# EAGLE design Arduino_MEGA2560_ref (EAGLE 6.5.0)
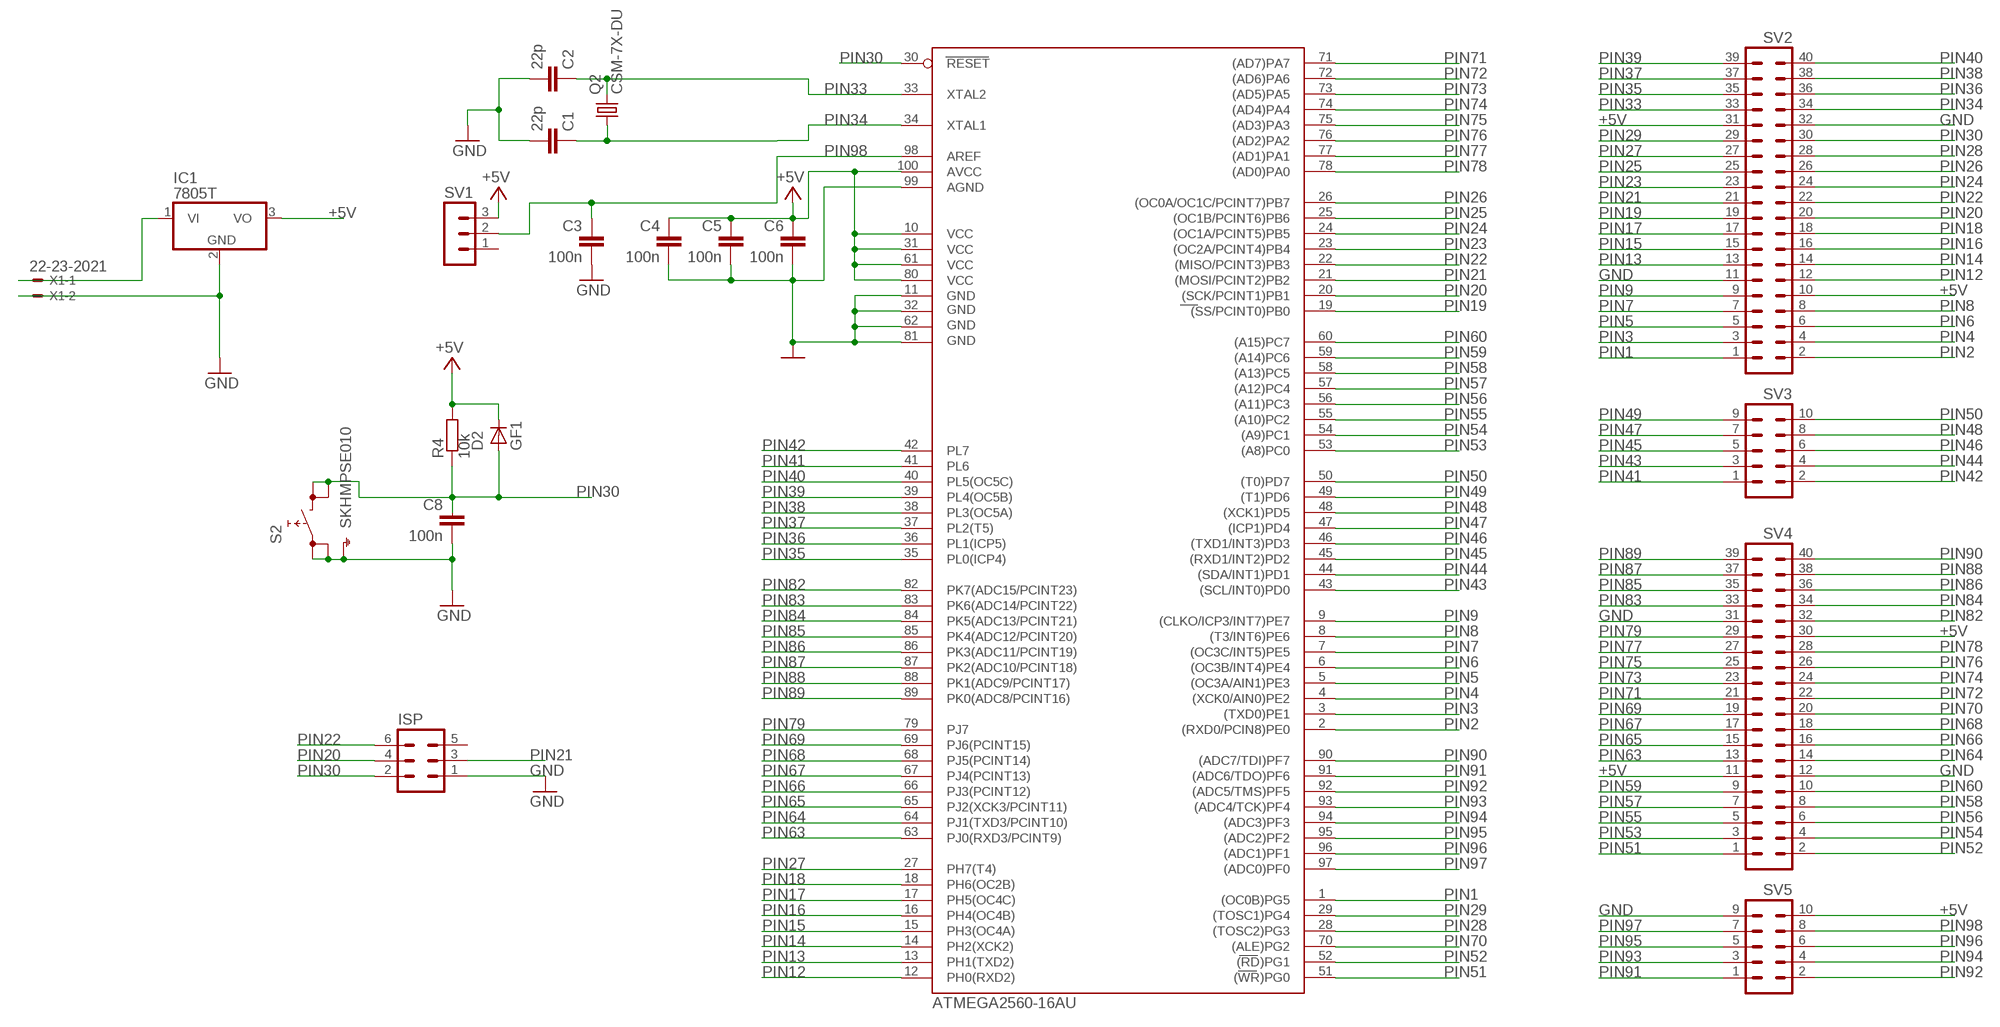
[diagram p0: schematic, sheet 1]

## Parts
C1  22p  C-EU0603-RND  [C0603-ROUND]
C2  22p  C-EU0603-RND  [C0603-ROUND]
C3  100n  C-EU0603-RND  [C0603-ROUND]
C4  100n  C-EU0603-RND  [C0603-ROUND]
C5  100n  C-EU0603-RND  [C0603-ROUND]
C6  100n  C-EU0603-RND  [C0603-ROUND]
C8  100n  C-EU0603-RND  [C0603-ROUND]
D2  GF1  [SMA-DO214AC]
IC1  7805T  [TO220H]
IC3  ATMEGA2560-16AU  ATMEGA1280-16AU  [TQFP100]
ISP  MA03-2  [MA03-2]
Q2  CSM-7X-DU  [CSM-7X-DU]
R4  10k  SMS-0  [SMS-0]
S2  SKHMPSE010  [SKHMPXE010]
SV1  MA03-1  [MA03-1]
SV2  MA20-2  [MA20-2]
SV3  MA05-2  [MA05-2]
SV4  MA20-2  [MA20-2]
SV5  MA05-2  [MA05-2]
X1  22-23-2021  [22-23-2021]

## Nets
+5V: C4.1 C5.1 C6.1 D2.K(C) IC1.3(VO) IC3.10(VCC) IC3.31(VCC1) IC3.61(VCC2) IC3.80(VCC3) IC3.100(AVCC) R4.1 SV1.3 SV2.10 SV2.31 SV4.11 SV4.30 SV5.10
GND: C1.2 C2.2 C3.2 C4.2 C5.2 C6.2 C8.2 IC1.2(GND) IC3.11(GND) IC3.32(GND1) IC3.62(GND2) IC3.81(GND3) IC3.99(AGND) ISP.1 S2.1(1.1) S2.2(1.2) S2.5(SH) SV2.11 SV2.32 SV4.12 SV4.31 SV5.9 X1.2
N$5: IC1.1(VI) X1.1
PIN1: IC3.1((OC0B)PG5) SV2.1
PIN2: IC3.2((RXD0/PCIN8)PE0) SV2.2
PIN3: IC3.3((TXD0)PE1) SV2.3
PIN4: IC3.4((XCK0/AIN0)PE2) SV2.4
PIN5: IC3.5((OC3A/AIN1)PE3) SV2.5
PIN6: IC3.6((OC3B/INT4)PE4) SV2.6
PIN7: IC3.7((OC3C/INT5)PE5) SV2.7
PIN8: IC3.8((T3/INT6)PE6) SV2.8
PIN9: IC3.9((CLKO/ICP3/INT7)PE7) SV2.9
PIN12: IC3.12(PH0(RXD2)) SV2.12
PIN13: IC3.13(PH1(TXD2)) SV2.13
PIN14: IC3.14(PH2(XCK2)) SV2.14
PIN15: IC3.15(PH3(OC4A)) SV2.15
PIN16: IC3.16(PH4(OC4B)) SV2.16
PIN17: IC3.17(PH5(OC4C)) SV2.17
PIN18: IC3.18(PH6(OC2B)) SV2.18
PIN19: IC3.19((SS/PCINT0)PB0) SV2.19
PIN20: IC3.20((SCK/PCINT1)PB1) ISP.4 SV2.20
PIN21: IC3.21((MOSI/PCINT2)PB2) ISP.3 SV2.21
PIN22: IC3.22((MISO/PCINT3)PB3) ISP.6 SV2.22
PIN23: IC3.23((OC2A/PCINT4)PB4) SV2.23
PIN24: IC3.24((OC1A/PCINT5)PB5) SV2.24
PIN25: IC3.25((OC1B/PCINT6)PB6) SV2.25
PIN26: IC3.26((OC0A/OC1C/PCINT7)PB7) SV2.26
PIN27: IC3.27(PH7(T4)) SV2.27
PIN28: IC3.28((TOSC2)PG3) SV2.28
PIN29: IC3.29((TOSC1)PG4) SV2.29
PIN30: C8.1 D2.A IC3.30(RESET) ISP.2 R4.2 S2.3(2.1) S2.4(2.2) SV2.30
PIN33: C2.1 IC3.33(XTAL2) Q2.2 SV2.33
PIN34: C1.1 IC3.34(XTAL1) Q2.1 SV2.34
PIN35: IC3.35(PL0(ICP4)) SV2.35
PIN36: IC3.36(PL1(ICP5)) SV2.36
PIN37: IC3.37(PL2(T5)) SV2.37
PIN38: IC3.38(PL3(OC5A)) SV2.38
PIN39: IC3.39(PL4(OC5B)) SV2.39
PIN40: IC3.40(PL5(OC5C)) SV2.40
PIN41: IC3.41(PL6) SV3.1
PIN42: IC3.42(PL7) SV3.2
PIN43: IC3.43((SCL/INT0)PD0) SV3.3
PIN44: IC3.44((SDA/INT1)PD1) SV3.4
PIN45: IC3.45((RXD1/INT2)PD2) SV3.5
PIN46: IC3.46((TXD1/INT3)PD3) SV3.6
PIN47: IC3.47((ICP1)PD4) SV3.7
PIN48: IC3.48((XCK1)PD5) SV3.8
PIN49: IC3.49((T1)PD6) SV3.9
PIN50: IC3.50((T0)PD7) SV3.10
PIN51: IC3.51((WR)PG0) SV4.1
PIN52: IC3.52((RD)PG1) SV4.2
PIN53: IC3.53((A8)PC0) SV4.3
PIN54: IC3.54((A9)PC1) SV4.4
PIN55: IC3.55((A10)PC2) SV4.5
PIN56: IC3.56((A11)PC3) SV4.6
PIN57: IC3.57((A12)PC4) SV4.7
PIN58: IC3.58((A13)PC5) SV4.8
PIN59: IC3.59((A14)PC6) SV4.9
PIN60: IC3.60((A15)PC7) SV4.10
PIN63: IC3.63(PJ0(RXD3/PCINT9)) SV4.13
PIN64: IC3.64(PJ1(TXD3/PCINT10)) SV4.14
PIN65: IC3.65(PJ2(XCK3/PCINT11)) SV4.15
PIN66: IC3.66(PJ3(PCINT12)) SV4.16
PIN67: IC3.67(PJ4(PCINT13)) SV4.17
PIN68: IC3.68(PJ5(PCINT14)) SV4.18
PIN69: IC3.69(PJ6(PCINT15)) SV4.19
PIN70: IC3.70((ALE)PG2) SV4.20
PIN71: IC3.71((AD7)PA7) SV4.21
PIN72: IC3.72((AD6)PA6) SV4.22
PIN73: IC3.73((AD5)PA5) SV4.23
PIN74: IC3.74((AD4)PA4) SV4.24
PIN75: IC3.75((AD3)PA3) SV4.25
PIN76: IC3.76((AD2)PA2) SV4.26
PIN77: IC3.77((AD1)PA1) SV4.27
PIN78: IC3.78((AD0)PA0) SV4.28
PIN79: IC3.79(PJ7) SV4.29
PIN82: IC3.82(PK7(ADC15/PCINT23)) SV4.32
PIN83: IC3.83(PK6(ADC14/PCINT22)) SV4.33
PIN84: IC3.84(PK5(ADC13/PCINT21)) SV4.34
PIN85: IC3.85(PK4(ADC12/PCINT20)) SV4.35
PIN86: IC3.86(PK3(ADC11/PCINT19)) SV4.36
PIN87: IC3.87(PK2(ADC10/PCINT18)) SV4.37
PIN88: IC3.88(PK1(ADC9/PCINT17)) SV4.38
PIN89: IC3.89(PK0(ADC8/PCINT16)) SV4.39
PIN90: IC3.90((ADC7/TDI)PF7) SV4.40
PIN91: IC3.91((ADC6/TDO)PF6) SV5.1
PIN92: IC3.92((ADC5/TMS)PF5) SV5.2
PIN93: IC3.93((ADC4/TCK)PF4) SV5.3
PIN94: IC3.94((ADC3)PF3) SV5.4
PIN95: IC3.95((ADC2)PF2) SV5.5
PIN96: IC3.96((ADC1)PF1) SV5.6
PIN97: IC3.97((ADC0)PF0) SV5.7
PIN98: C3.1 IC3.98(AREF) SV1.2 SV5.8
Unconnected: ISP.5 SV1.1

## Library data of the parts
C1-C6 C8 = SmartPrj:C-EU: CAPACITOR, European symbol
D2 = diode:GF1: DIODE
IC1 = linear:78*: Positive VOLTAGE REGULATOR Source: http://cache.national.com/ds/LM/LM78L05.pdf http://www.fairchildsemi.com/ds/LM/LM7805.pdf
IC3 = atmel-2005:ATMEGA*: MICROCONTROLLER 64/128/256 Kbytes FLASH 4 Kbytes EEPROM 8 Kbytes SRAM 86 General Purpose I/O pins 12-channels16-bit PWM 4 x Serial USARTs 16-channels 10-bit A/D
ISP = con-lstb:MA03-2: PIN HEADER; OC_FARNELL: unknown; OC_NEWARK: unknown
Q2 = crystal:CSM-7X-DU: SMD CRYSTAL Source: www.ecsxtal.com .. Crystal 3.6864MHz CSM_7X_DU.PDF; OC_FARNELL: unknown; OC_NEWARK: unknown
R4 = resistor-shunt:SMS-0: SMD SHUNT RESISTOR; OC_FARNELL: unknown; OC_NEWARK: unknown
S2 = switch:SKHMP*E010: 6.2 X 6.5mm TACT Switch (SMD) Source: http://www3.alps.co.jp/WebObjects/catalog.woa/PDF/E/Switch/Tact/SKHM/SKHM.PDF
SV1 = con-lstb:MA03-1: PIN HEADER; OC_FARNELL: unknown; OC_NEWARK: unknown
SV2 SV4 = con-lstb:MA20-2: PIN HEADER; OC_FARNELL: unknown; OC_NEWARK: unknown
SV3 SV5 = con-lstb:MA05-2: PIN HEADER; OC_FARNELL: unknown; OC_NEWARK: unknown
X1 = con-molex:22-23-2021: .100" (2.54mm) Center Header - 2 Pin; MF: MOLEX; MPN: 22-23-2021; OC_FARNELL: 1462926; OC_NEWARK: 25C3832

## Net classes
0 default: width 0.152 mm, drill 0.305 mm, clearance 0.152 mm

## Board
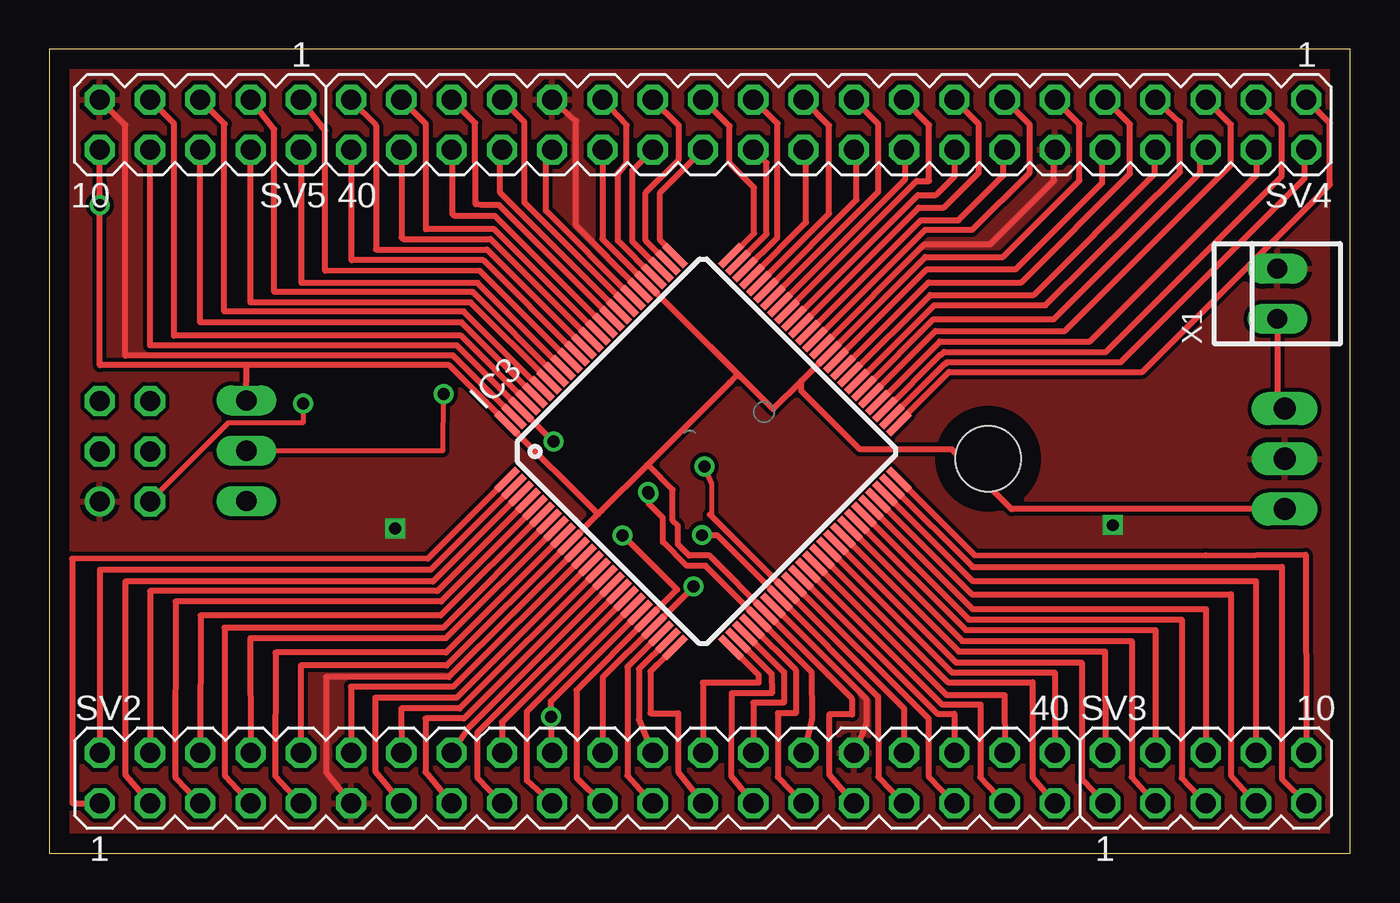
[diagram p1: board, top side]
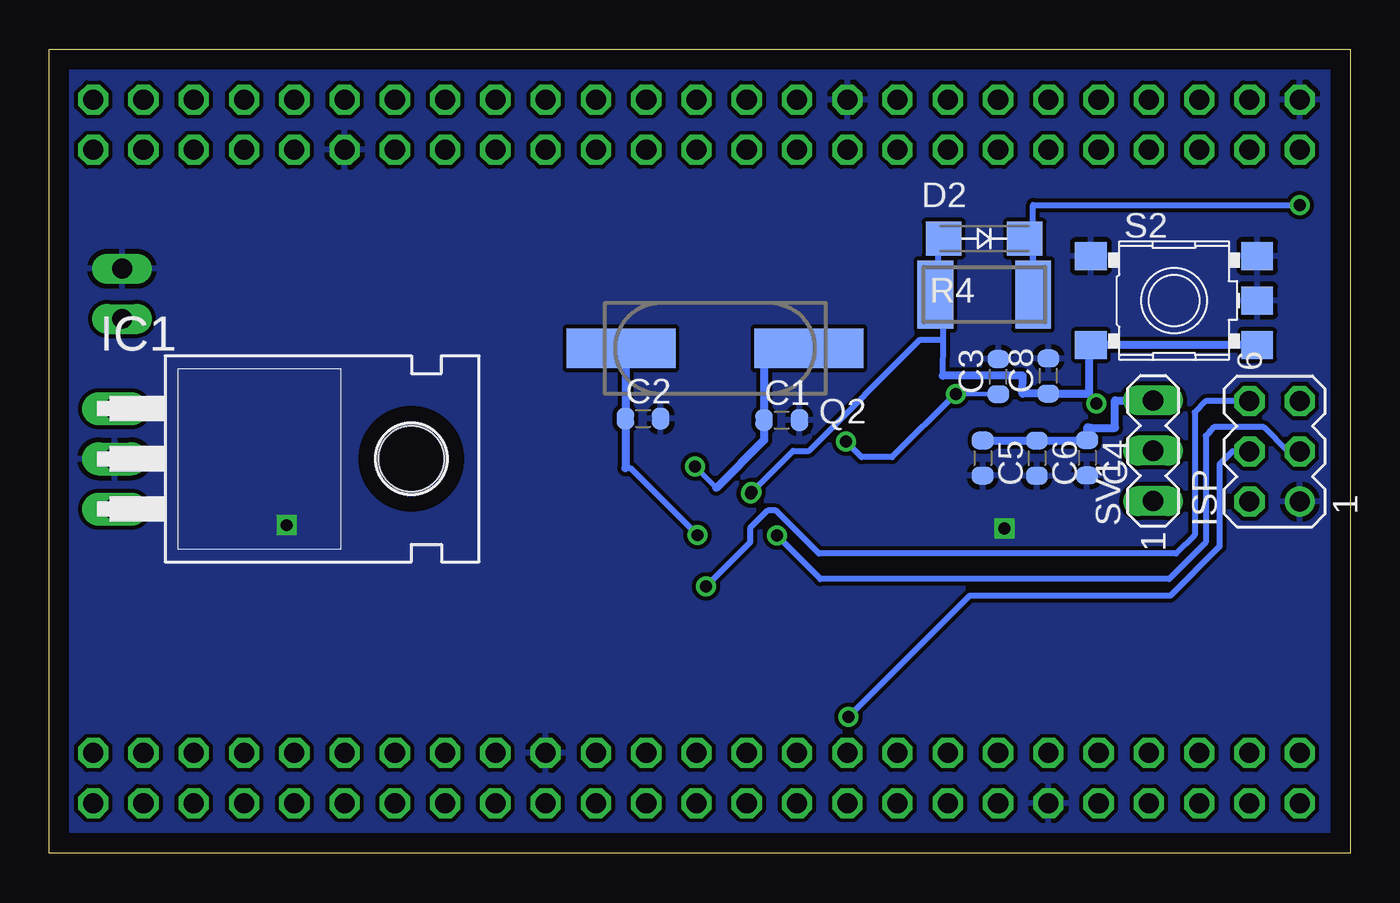
[diagram p2: board, bottom side, seen from below]

Size 65.71 x 40.63 mm. Coordinates in mm from the lower left corner, seen from the top.
Outline: 0,0 65.71,0 65.71,40.63 0,40.63 0,0
Copper layers (1*16): Top 0.035mm / dielectric 1.5mm / Bottom 0.035mm
Design rules "default": minimum track width 10mil, minimum drill 24mil, track to track 8mil, track to pad 8mil, pad to pad 8mil, via to via 8mil, smd to smd 8mil, copper to edge 40mil, drill to drill 8mil, minimum pad ring 10mil, minimum via ring 8mil, stop-mask expansion 4mil, vias tented up to drill 0mil, thermal gap 10mil

### Footprints (pad centres in the part's own frame; a part is rotated, then mirrored left to right if it is on the bottom)
C0603-ROUND = smd 0.898 x 1.1: 1 -0.889,0; 2 0.889,0
SMA-DO214AC = smd 1.8 x 1.7: A -2.05,0; K 2.05,0
TO220H = drill 1.118 long: 1 -2.54,-10.16; 2 0,-10.16; 3 2.54,-10.16 | hole 3.302: 0,4.826
TQFP100 = smd 1.5 x 0.35: 1 -8,6; 2 -8,5.5; 3 -8,5; 4 -8,4.5; 5 -8,4; 6 -8,3.5; 7 -8,3; 8 -8,2.5; 9 -8,2; 10 -8,1.5; 11 -8,1; 12 -8,0.5; 13 -8,0; 14 -8,-0.5; 15 -8,-1; 16 -8,-1.5; 17 -8,-2; 18 -8,-2.5; 19 -8,-3; 20 -8,-3.5; 21 -8,-4; 22 -8,-4.5; 23 -8,-5; 24 -8,-5.5; 25 -8,-6; 51 8,-6; 52 8,-5.5; 53 8,-5; 54 8,-4.5; 55 8,-4; 56 8,-3.5; 57 8,-3; 58 8,-2.5; 59 8,-2; 60 8,-1.5; 61 8,-1; 62 8,-0.5; 63 8,0; 64 8,0.5; 65 8,1; 66 8,1.5; 67 8,2; 68 8,2.5; 69 8,3; 70 8,3.5; 71 8,4; 72 8,4.5; 73 8,5; 74 8,5.5; 75 8,6 | smd 0.35 x 1.5: 26 -6,-8; 27 -5.5,-8; 28 -5,-8; 29 -4.5,-8; 30 -4,-8; 31 -3.5,-8; 32 -3,-8; 33 -2.5,-8; 34 -2,-8; 35 -1.5,-8; 36 -1,-8; 37 -0.5,-8; 38 0,-8; 39 0.5,-8; 40 1,-8; 41 1.5,-8; 42 2,-8; 43 2.5,-8; 44 3,-8; 45 3.5,-8; 46 4,-8; 47 4.5,-8; 48 5,-8; 49 5.5,-8; 50 6,-8; 76 6,8; 77 5.5,8; 78 5,8; 79 4.5,8; 80 4,8; 81 3.5,8; 82 3,8; 83 2.5,8; 84 2,8; 85 1.5,8; 86 1,8; 87 0.5,8; 88 0,8; 89 -0.5,8; 90 -1,8; 91 -1.5,8; 92 -2,8; 93 -2.5,8; 94 -3,8; 95 -3.5,8; 96 -4,8; 97 -4.5,8; 98 -5,8; 99 -5.5,8; 100 -6,8
MA03-2 = drill 1.016: 1 -2.54,-1.27 | drill 1.016 octagon: 2 -2.54,1.27; 3 0,-1.27; 4 0,1.27; 5 2.54,-1.27; 6 2.54,1.27
CSM-7X-DU = smd 5.5 x 2: 1 -4.75,0; 2 4.75,0
SMS-0 = smd 1.8 x 3.45: 1 2.464,0; 2 -2.464,0
SKHMPXE010 = smd 1.6 x 1.4: 1 -4.2,2.25; 2 4.2,2.25; 3 -4.2,-2.25; 4 4.2,-2.25; 5 4.2,0
MA03-1 = drill 1.016 long: 1 -2.54,0; 2 0,0; 3 2.54,0
MA20-2 = drill 1.016 octagon: 1 -24.13,-1.27; 2 -24.13,1.27; 3 -21.59,-1.27; 4 -21.59,1.27; 5 -19.05,-1.27; 6 -19.05,1.27; 7 -16.51,-1.27; 8 -16.51,1.27; 9 -13.97,-1.27; 10 -13.97,1.27; 11 -11.43,-1.27; 12 -11.43,1.27; 13 -8.89,-1.27; 14 -8.89,1.27; 15 -6.35,-1.27; 16 -6.35,1.27; 17 -3.81,-1.27; 18 -3.81,1.27; 19 -1.27,-1.27; 20 -1.27,1.27; 21 1.27,-1.27; 22 1.27,1.27; 23 3.81,-1.27; 24 3.81,1.27; 25 6.35,-1.27; 26 6.35,1.27; 27 8.89,-1.27; 28 8.89,1.27; 29 11.43,-1.27; 30 11.43,1.27; 31 13.97,-1.27; 32 13.97,1.27; 33 16.51,-1.27; 34 16.51,1.27; 35 19.05,-1.27; 36 19.05,1.27; 37 21.59,-1.27; 38 21.59,1.27; 39 24.13,-1.27; 40 24.13,1.27
MA05-2 = drill 1.016 octagon: 1 -5.08,-1.27; 2 -5.08,1.27; 3 -2.54,-1.27; 4 -2.54,1.27; 5 0,-1.27; 6 0,1.27; 7 2.54,-1.27; 8 2.54,1.27; 9 5.08,-1.27; 10 5.08,1.27
22-23-2021 = drill 1 long: 1 -1.27,0; 2 1.27,0

### Placement (x,y rotation side)
C1  28.71,21.9 0 bottom
C2  35.72,21.97 0 bottom
C3  17.77,24.1 90 bottom
C4  13.28,20 270 bottom
C5  18.56,19.98 270 bottom
C6  15.83,19.98 270 bottom
C8  15.24,24.13 90 bottom
D2  18.48,31.07 0 bottom
IC1  52.25,19.94 270 bottom
IC3  33.02,20.32 45 top
ISP  3.81,20.32 90 bottom
Q2  32.08,25.53 180 bottom
R4  18.48,28.24 0 bottom
S2  8.89,27.94 0 bottom
SV1  9.95,20.35 90 bottom
SV2  26.67,3.81 0 top
SV3  58.42,3.81 0 top
SV4  39.37,36.83 180 top
SV5  7.62,36.83 180 top
X1  62.04,28.28 90 top

### Tracks (layer width: path | path; a pad name or v marks a point on that pad's centre or on a via)
+5V  (via drill 0.6)
  Top 0.305: 9.96,24.68 20.19,24.68 23.12,21.75 IC3.100 27.72,17.15 | 9.96,24.68 2.54,24.68 2.54,33.86 | 2.54,33.86 SV5.10 | SV4.30 27.94,31.06 IC3.80 | SV4.11 52.04,36.86 52.04,34.01 48.17,30.14 44.25,30.14 IC3.61 37.99,23.87 | SV2.31 39.39,4.01 39.39,7.02 40.55,7.02 40.54,7.84 39.36,9.03 IC3.31 33.45,14.96 33.35,15.06 32.32,15.06 31.75,15.62 31.75,16.57 31.49,16.83 31.49,18.38 30.25,19.61 30.18,19.61 | SV2.10 12.7,9.5 20.07,9.5 IC3.10 27.72,17.15 | IC3.80 36.56,22.45 37.99,23.87 | IC3.80 34.77,24.22 | 34.77,24.22 34.95,24.04 | 27.72,17.15 27.9,17.33 30.18,19.61 | 30.18,19.61 34.37,23.81 34.77,24.22 | SV1.3 9.96,24.68 | IC1.3 48.61,17.4 45.59,20.42 40.95,20.42 37.99,23.38 37.99,23.87 | v2.54,32.76 2.55,33.23 2.54,33.86
  Bottom 0.305: D2.K 16.02,30.66 R4.1 16.02,32.76 v2.54,32.76
  Bottom 0.406: C5.1 C6.1 13.28,20.87 C4.1 13.26,21.54 13.08,21.51 11.87,21.51 11.87,22.89 SV1.3
GND  (via drill 0.6)
  Top 0.305: IC3.99 20.39,25.15 3.83,25.15 3.83,36.81 SV5.9 | IC3.81 26.61,31.72 26.61,37.01 SV4.31 | IC3.62 39.06,25.62 44.22,30.78 47.53,30.78 50.75,34.01 50.75,35.51 SV4.12 | IC3.32 41.27,7.82 41.27,6.56 SV2.32 | IC3.11 20.17,8.92 13.97,8.92 13.98,4.11 SV2.11
  Bottom 0.254: S2.5 4.71,27.95 4.84,27.95 | S2.2 4.71,30.2 4.84,30.2
  other vias: 17.45,16.42 53.72,16.59
  pour Bottom: -0.65,40.98 66.38,40.98 66.38,35.56 66.38,-0.35 -0.66,-0.35 -0.66,40.98
  pour Top: -0.63,41.18 66.2,41.18 66.2,-0.53 -0.42,-0.53 -0.42,-0.42 -0.74,-0.42 -0.74,41.08
N$1  (via drill 0.6)
  other vias: 30.24,18.26
N$5
  Top 0.305: X1.1 62.04,22.85 IC1.1
PIN1
  Top 0.305: IC3.1 19.11,14.89 1.14,14.9 1.16,2.54 SV2.1
PIN2
  Top 0.305: IC3.2 19.26,14.34 2.54,14.33 SV2.2
PIN3
  Top 0.305: IC3.3 19.38,13.74 3.83,13.74 3.83,3.98 SV2.3
PIN4
  Top 0.305: IC3.4 19.61,13.27 5.08,13.27 SV2.4
PIN5
  Top 0.305: IC3.5 19.79,12.73 6.37,12.73 6.36,3.86 SV2.5
PIN6
  Top 0.305: IC3.6 19.76,12.03 7.64,12.02 SV2.6
PIN7
  Top 0.305: IC3.7 19.89,11.4 8.85,11.4 8.86,3.95 SV2.7
PIN8
  Top 0.305: IC3.8 20.02,10.88 10.15,10.88 SV2.8
PIN9
  Top 0.305: IC3.9 20.03,10.16 11.42,10.16 11.41,3.92 SV2.9
PIN12
  Top 0.305: IC3.12 20.39,8.43 15.24,8.42 SV2.12
PIN13
  Top 0.305: IC3.13 20.57,7.87 16.45,7.87 16.46,4.14 SV2.13
PIN14
  Top 0.305: IC3.14 20.73,7.32 17.77,7.33 SV2.14
PIN15
  Top 0.305: IC3.15 20.94,6.82 19,6.82 19,4.11 SV2.15
PIN16
  Top 0.305: IC3.16 21.12,6.29 SV2.16
PIN17
  Top 0.305: IC3.17 21.61,6.08 21.61,3.85 SV2.17
PIN18
  Top 0.305: IC3.18 22.86,6.63 SV2.18
PIN19
  Top 0.305: IC3.19 24.11,7.16 24.11,3.69 SV2.19
PIN20  (via drill 0.6)
  Top 0.305: IC3.20 25.34,7.69 v25.34,6.91 25.34,5.14 SV2.20
  Bottom 0.305: ISP.4 5.94,20.32 6.6,19.66 6.6,15.51 9.09,13.02 19.23,13.02 v25.34,6.91
PIN21  (via drill 0.6)
  Top 0.305: SV2.21 26.64,3.81 26.62,8.25 IC3.21 31.68,13.32 31.73,13.32 28.99,16.07 v28.96,16.07
  Bottom 0.305: ISP.3 3.15,20.32 4.37,21.54 6.88,21.54 7.07,21.35 7.07,21.32 7.29,21.1 7.29,15.72 9.14,13.87 26.76,13.87 v28.96,16.07
PIN22  (via drill 0.6)
  Top 0.305: SV2.22 27.95,8.89 IC3.22 32.54,13.48 v32.54,13.49
  Bottom 0.305: ISP.6 7.29,22.86 7.85,22.29 7.85,16.1 8.79,15.16 26.82,15.16 28.99,17.32 29.43,17.32 30.31,16.45 30.31,15.72 v32.54,13.49
PIN23
  Top 0.305: IC3.23 29.2,9.42 29.2,3.95 SV2.23
PIN24
  Top 0.305: IC3.24 29.79,9.32 29.79,6.76 SV2.24
PIN25
  Top 0.305: IC3.25 30.66,9.51 30.36,9.2 30.36,7.08 31.76,7.08 31.76,4.13 SV2.25
PIN26
  Top 0.305: IC3.26 35.83,9.02 35.83,8.63 33.02,8.63 SV2.26
PIN27
  Top 0.305: IC3.27 36.48,9.08 36.49,8.1 35.11,8.1 34.46,8.1 34.44,3.92 SV2.27
PIN28
  Top 0.305: IC3.28 36.63,9.64 37.12,9.15 37.11,7.61 35.56,7.61 SV2.28
PIN29
  Top 0.305: IC3.29 37.7,9.28 37.7,7.09 36.81,7.09 36.81,3.87 SV2.29
PIN30  (via drill 0.6, 0.61)
  Top 0.254: v12.81,22.74 12.81,21.76 9.04,21.76 5.09,17.82 ISP.2
  Top 0.305: SV2.30 38.52,6.78 38.51,9.16 IC3.30 33.15,14.53 32.19,14.53 30.99,15.73 30.99,16.96 30.28,17.67 v30.28,18.2
  Bottom 0.254: S2.3 13.11,25.7 13.11,25.69 | v12.81,22.74 13.11,23.03 13.19,23.21 | 20.57,28.25 20.91,28.25 R4.2
  Bottom 0.305: v30.28,18.2 28.13,20.34 27.35,20.34 21.72,25.97 20.57,25.97 | 20.57,25.97 20.59,24.15 | D2.A 20.82,30.78 20.82,29.4 20.57,29.15 20.57,28.25 20.57,25.97
  Bottom 0.406: S2.4 S2.3 13.11,25.69 13.19,25.69 13.19,23.21 15.24,23.21 C8.1 16.55,23.24 16.54,24.14 20.59,24.15
PIN33  (via drill 0.6)
  Top 0.305: SV2.33 41.88,3.88 41.87,7.92 IC3.33 36.91,12.91 33.74,16.09 v32.98,16.09
  Bottom 0.254: 43.14,2.54 SV2.33
  Bottom 0.305: 36.61,19.47 36.36,19.47 v32.98,16.09
  Bottom 0.406: Q2.2 36.61,25.53 C2.1 36.61,19.47
PIN34  (via drill 0.61)
  Top 0.254: v33.1,19.55 33.47,18.66 33.47,17.22 33.37,17.12
  Top 0.305: SV2.34 43.17,5.72 43.17,7.33 IC3.34 33.37,17.12
  Bottom 0.254: v33.1,19.55 32.24,18.71 32.15,18.62 32.01,18.48
  Bottom 0.406: Q2.1 29.6,25.53 C1.1 29.6,20.89 32.01,18.48
PIN35
  Top 0.305: IC3.35 44.42,6.82 44.41,3.9 SV2.35
PIN36
  Top 0.305: IC3.36 44.86,7.06 45.71,7.06 SV2.36
PIN37
  Top 0.305: IC3.37 45.1,7.53 47.04,7.53 47.03,3.86 SV2.37
PIN38
  Top 0.305: IC3.38 45.32,8.01 48.25,8.01 SV2.38
PIN39
  Top 0.305: IC3.39 45.39,8.65 49.67,8.65 49.67,3.84 SV2.39
PIN40
  Top 0.305: IC3.40 45.6,9.15 50.79,9.15 SV2.40
PIN41
  Top 0.305: IC3.41 45.8,9.64 52.16,9.64 52.16,3.78 SV3.1
PIN42
  Top 0.305: IC3.42 45.95,10.2 53.33,10.2 SV3.2
PIN43
  Top 0.305: IC3.43 46.12,10.73 54.68,10.73 54.68,3.87 SV3.3
PIN44
  Top 0.305: IC3.44 46.3,11.29 55.88,11.29 SV3.4
PIN45
  Top 0.305: IC3.45 46.45,11.82 57.21,11.82 57.21,3.81 SV3.5
PIN46
  Top 0.305: IC3.46 46.64,12.36 58.43,12.36 SV3.6
PIN47
  Top 0.305: IC3.47 46.6,13.1 59.69,13.1 59.69,3.94 SV3.7
PIN48
  Top 0.305: IC3.48 46.62,13.78 60.96,13.77 SV3.8
PIN49
  Top 0.305: IC3.49 46.65,14.47 62.27,14.48 62.27,3.75 SV3.9
PIN50
  Top 0.305: IC3.50 46.74,15.08 58.42,15.07 63.47,15.1 SV3.10
PIN51
  Top 0.305: IC3.51 42.92,21.8 45.45,24.33 55.22,24.33 64.69,33.8 64.69,36.91 SV4.1
PIN52
  Top 0.305: IC3.52 45.2,24.72 45.23,24.72 45.34,24.82 54.12,24.82 63.42,34.12 63.42,35.48 SV4.2
PIN53
  Top 0.305: IC3.53 42.25,22.44 45.02,25.21 45.06,25.21 45.2,25.35 53.38,25.35 62.26,34.22 62.26,36.8 SV4.3
PIN54
  Top 0.305: IC3.54 41.9,22.8 44.99,25.88 52.57,25.88 60.99,34.29 60.99,35.53 SV4.4
PIN55
  Top 0.305: IC3.55 44.63,26.27 | 44.63,26.27 | 44.63,26.27 44.77,26.41 51.31,26.41 59.69,34.79 59.69,36.83 SV4.5
PIN56
  Top 0.305: IC3.56 41.17,23.5 44.67,27 50.75,27 58.14,34.4 58.14,35.28 SV4.6
PIN57
  Top 0.305: IC3.57 40.85,23.86 44.7,27.71 50.33,27.71 57.12,34.43 57.12,36.97 SV4.7
PIN58
  Top 0.305: IC3.58 40.48,24.21 44.5,28.23 49.73,28.23 55.85,34.35 55.85,35.53 SV4.8
PIN59
  Top 0.305: IC3.59 40.12,24.56 44.41,28.86 49.09,28.86 54.59,34.35 54.59,36.85 SV4.9
PIN60
  Top 0.305: IC3.60 44.34,29.52 48.82,29.52 53.19,33.89 53.19,35.41 SV4.10
PIN63
  Top 0.305: IC3.63 38.71,25.98 44.25,31.52 46.62,31.52 49.52,34.42 49.52,36.84 SV4.13
PIN64
  Top 0.305: IC3.64 38.35,26.33 44.03,32 45.93,32 48.2,34.28 48.2,35.5 SV4.14
PIN65
  Top 0.305: IC3.65 43.93,32.64 45.2,32.64 46.96,34.4 46.96,36.86 SV4.15
PIN66
  Top 0.305: IC3.66 37.64,27.04 43.88,33.27 44.78,33.27 45.73,34.23 45.73,35.55 SV4.16
PIN67
  Top 0.305: IC3.67 37.26,27.44 43.81,33.98 44.44,33.98 44.44,36.81 SV4.17
PIN68
  Top 0.305: IC3.68 | IC3.68 43.24,34.08 43.24,35.5 SV4.18
PIN69
  Top 0.305: IC3.69 36.56,28.12 41.88,33.45 41.88,36.86 SV4.19
PIN70
  Top 0.305: IC3.70 40.78,33.03 40.78,35.42 SV4.20
PIN71
  Top 0.305: IC3.71 39.39,32.35 39.39,36.79 SV4.21
PIN72
  Top 0.305: IC3.72 38.23,31.9 38.23,35.43 SV4.22
PIN73
  Top 0.305: IC3.73 36.77,31.13 36.79,36.89 SV4.23
PIN74
  Top 0.305: IC3.74 36.23,31.3 36.23,34.89 SV4.24
PIN75
  Top 0.305: IC3.75 34.48,30.22 35.6,31.34 35.6,33.64 34.37,34.88 34.37,36.76 SV4.25
PIN76
  Top 0.305: IC3.76 31.61,30.24 30.86,30.99 30.86,33.4 SV4.26
PIN77
  Top 0.305: IC3.77 31.22,29.87 30.12,30.96 30.12,33.39 31.79,35.06 31.79,36.79 SV4.27
PIN78
  Top 0.305: IC3.78 30.87,29.51 29.45,30.93 29.45,34.53 SV4.28
PIN79
  Top 0.305: IC3.79 30.52,29.16 28.72,30.96 28.72,34.36 29.16,34.89 29.16,36.8 SV4.29
PIN82
  Top 0.305: IC3.82 29.47,28.1 25.08,32.48 25.08,35.24 SV4.32
PIN83
  Top 0.305: IC3.83 29.13,27.76 24,32.89 24,36.96 SV4.33
PIN84
  Top 0.305: IC3.84 28.77,27.39 23.12,33.04 22.77,33.39 22.77,35.47 SV4.34
PIN85
  Top 0.305: IC3.85 28.42,27.06 22.71,32.78 21.83,32.78 21.54,32.8 21.51,36.91 SV4.35
PIN86
  Top 0.305: IC3.86 28.04,26.68 22.51,32.22 20.47,32.22 20.36,32.32 20.36,35.52 SV4.36
PIN87
  Top 0.305: IC3.87 27.69,26.33 22.48,31.55 19.03,31.55 19.03,36.86 SV4.37
PIN88
  Top 0.305: SV4.38 17.78,31.14 17.87,31.05 22.29,31.05 IC3.88
PIN89
  Top 0.305: SV4.39 15.24,38.05 16.5,36.79 16.5,30.53 22.11,30.53 IC3.89
PIN90
  Top 0.305: IC3.90 26.63,25.27 21.93,29.98 15.29,29.98 15.26,30 15.26,35.54 SV4.40
PIN91
  Top 0.305: IC3.91 26.28,24.92 21.74,29.45 13.93,29.43 13.93,36.53 SV5.1
PIN92
  Top 0.305: IC3.92 25.9,24.56 21.63,28.84 12.73,28.84 12.73,35.53 SV5.2
PIN93
  Top 0.305: IC3.93 25.55,24.21 21.53,28.24 21.39,28.38 11.36,28.38 11.36,36.58 SV5.3
PIN94
  Top 0.305: IC3.94 25.24,23.89 21.28,27.85 10.16,27.85 SV5.4
PIN95
  Top 0.305: IC3.95 24.82,23.5 20.93,27.39 8.83,27.39 8.83,36.86 8.86,36.86 SV5.5
PIN96
  Top 0.305: IC3.96 24.5,23.15 20.82,26.83 7.62,26.83 SV5.6
PIN97
  Top 0.305: IC3.97 24.15,22.8 20.79,26.16 6.3,26.16 6.3,36.88 SV5.7
PIN98  (via drill 0.6, 0.61)
  Top 0.254: v19.91,23.22 19.88,20.36 9.97,20.36 SV1.2
  Top 0.305: SV5.8 5.07,35.56 5.07,25.69 20.58,25.69 IC3.98 25.45,20.81 v25.47,20.81
  Bottom 0.254: v19.91,23.22 17.77,23.25 C3.1 | 5.05,35.55 SV5.8 4.96,35.46
  Bottom 0.305: v19.91,23.22 19.95,23.22 23.14,20.03 24.68,20.03 v25.47,20.81